# Altium project MB1168.PrjPCB (part 2 of 2)

## Sheet Power.SchDoc: Power
size A3; Project: STM32L073Z-EVAL; Date: Not used; ApprovedBy: Not used; CheckedBy: Not used; Author: Not used; CompanyName: STMicroelectronics; DrawnBy: Not used; Engineer: Not used; Organization: Not used; Address1: Not used; Address2: Not used; Address3: Not used; Address4: Not used; DocumentNumber: 4; Revision: Not used; SheetNumber: 5; SheetTotal: 13; CurrentTime: Not used; CurrentDate: Not used; Time: Not used; DocumentFullPathAndName: Not used; DocumentName: Not used; ModifiedDate: Not used; ImagePath: Not used; ProjectName: Not used; Application_BuildNumber: Not used
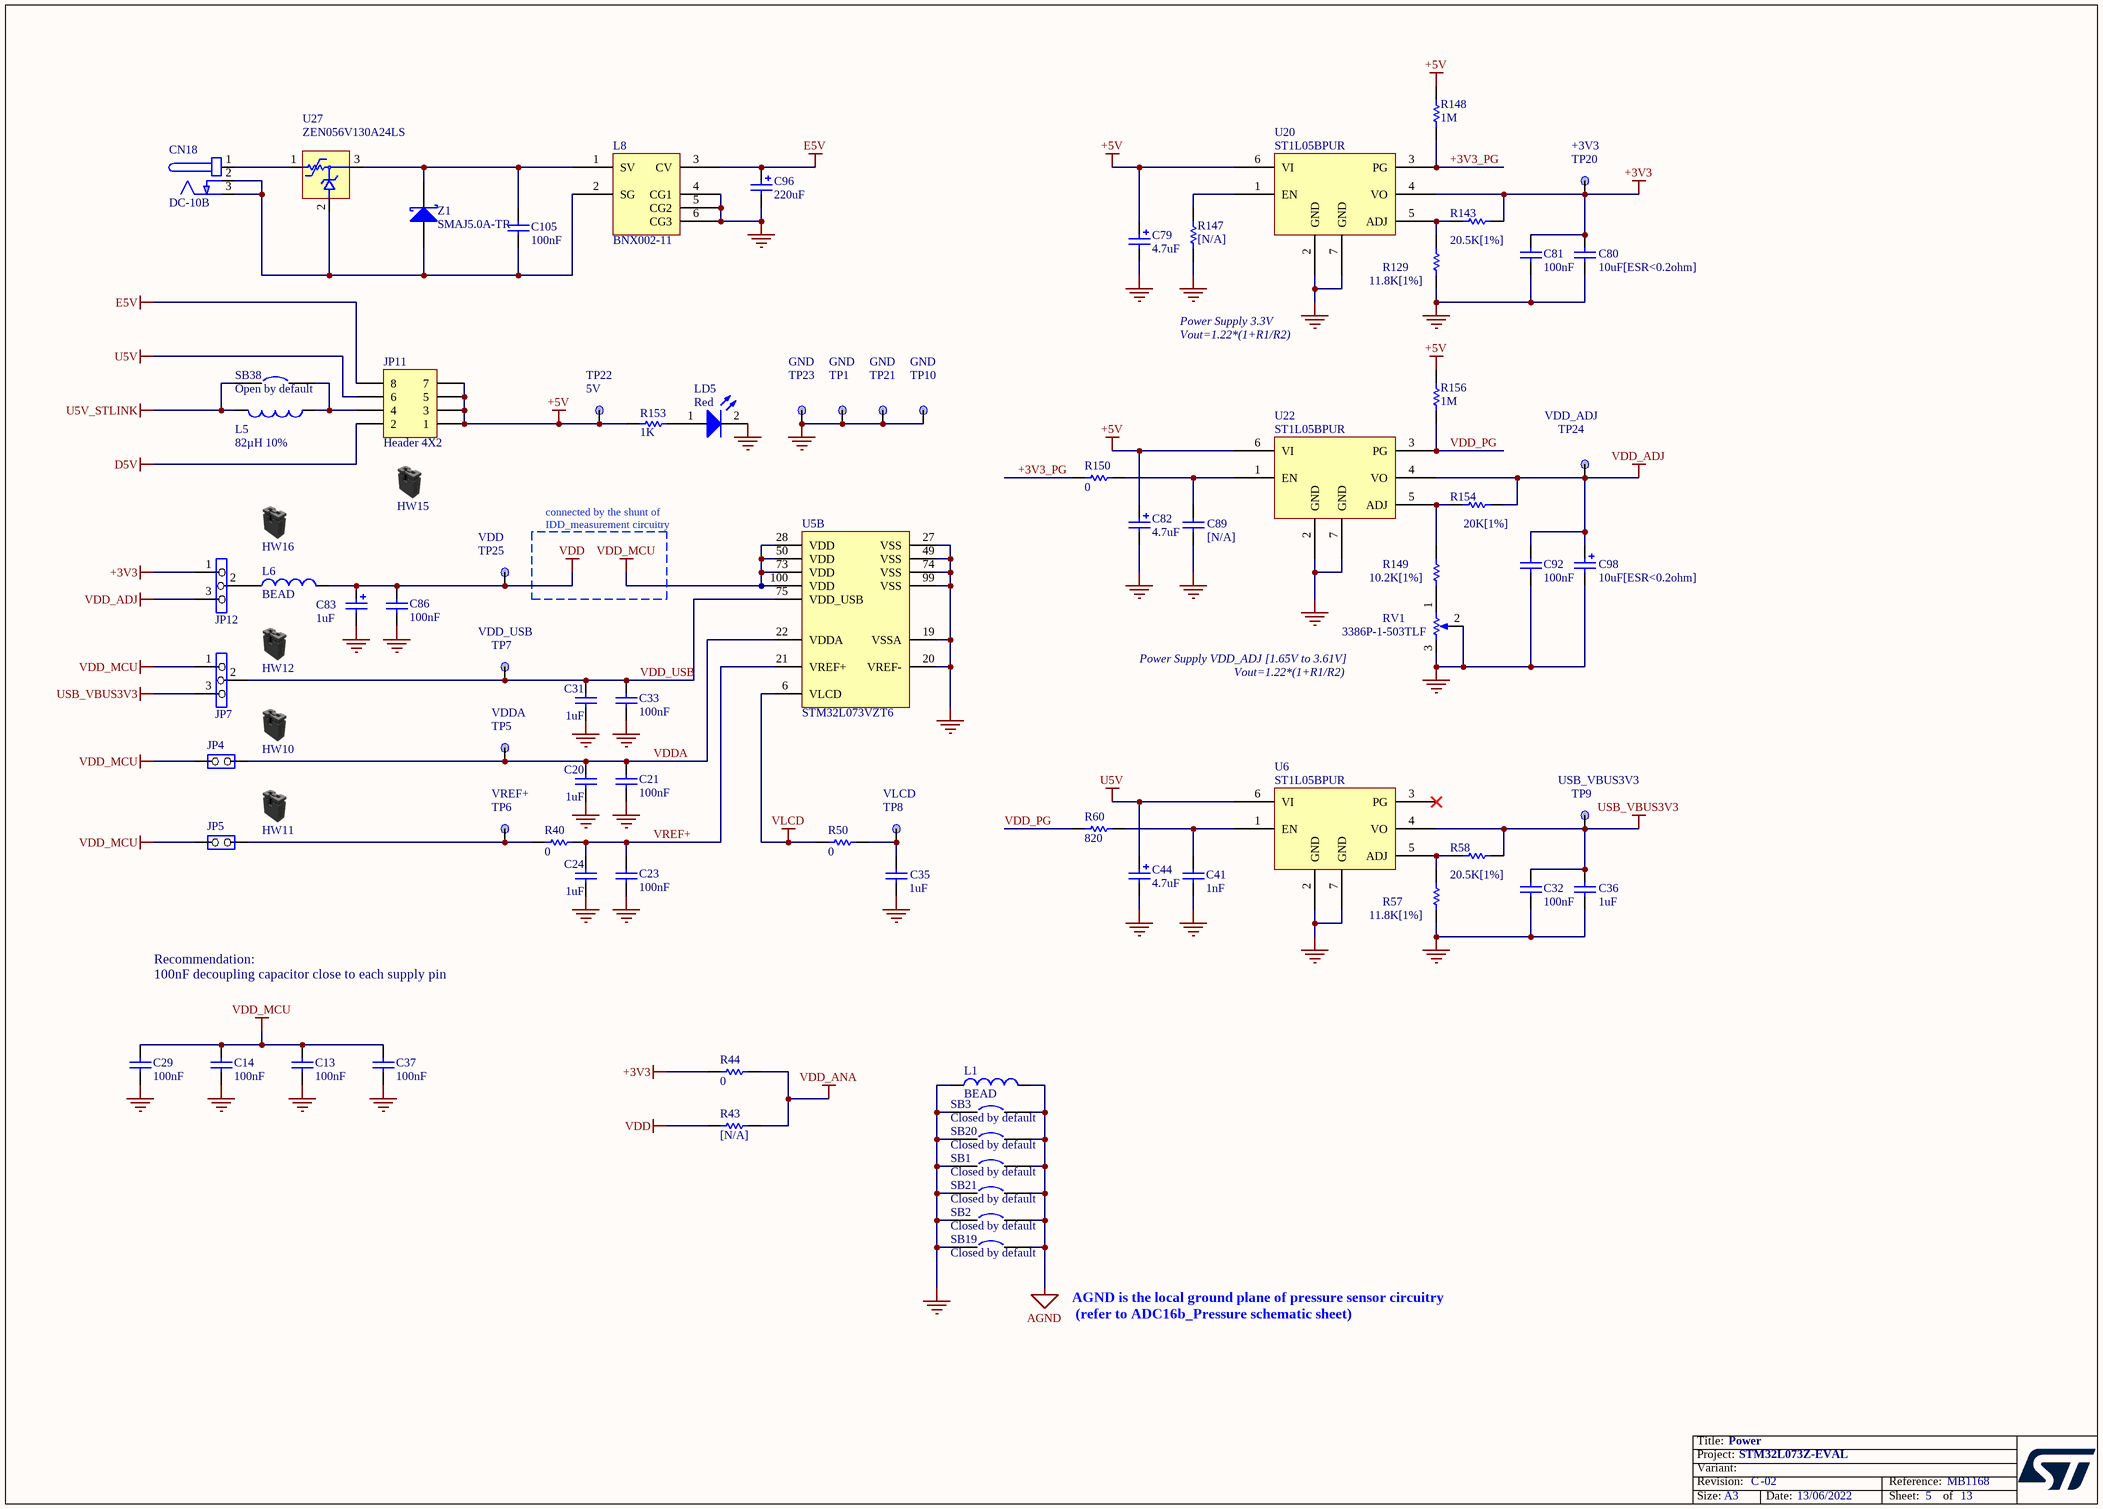
[diagram p4: Power.SchDoc]

### Parts
C13  100nF  [0402C]
C14  100nF  [0402C]
C20  1uF  [0603C]
C21  100nF  [0402C]
C23  100nF  [0402C]
C24  1uF  [0603C]
C29  100nF  [0402C]
C31  1uF  [0603C]
C32  100nF  [0402C]
C33  100nF  [0402C]
C35  1uF  [0603C]
C36  1uF  [0603C]
C37  100nF  [0402C]
C41  1nF  [0603C]
C44  4.7uF  [TAN-A]
C79  4.7uF  [TAN-A]
C80  10uF[ESR<0.2ohm]  [0805C]
C81  100nF  [0402C]
C82  4.7uF  [TAN-A]
C83  1uF  [TAN-A]
C86  100nF  [0402C]
C89  [N/A]  [0603C]
C92  100nF  [0402C]
C96  220uF  [c310m-6]
C98  10uF[ESR<0.2ohm]  [0805C]
C105  100nF  [0402C]
CN18  DC-10B  [PWR_JACK_DC10]
HW10  Shunt Black 2.54mm  (value not drawn)  (mechanical)
HW11  Shunt Black 2.54mm  (value not drawn)  (mechanical)
HW12  Shunt Black 2.54mm  (value not drawn)  (mechanical)
HW15  Shunt Black 2.54mm  (value not drawn)  (mechanical)
HW16  Shunt Black 2.54mm  (value not drawn)  (mechanical)
JP4  (no value)  [SIP2]
JP5  (no value)  [SIP2]
JP7  (no value)  [SIP3]
JP11  Header 4X2  [HDR_2X4_2R54]
JP12  (no value)  [SIP3]
L1  BEAD  [0603L]
L5  82µH 10%  [LSM2_4R9X4R9_H4R1]
L6  BEAD  [0603L]
L8  BNX002-11  [BNX001]
LD5  Red  [0603D]
R40  0  [0603R]
R43  [N/A]  [0603R]
R44  0  [0603R]
R50  0  [0603R]
R57  11.8K[1%]  [0603R]
R58  20.5K[1%]  [0603R]
R60  820  [0603R]
R129  11.8K[1%]  [0603R]
R143  20.5K[1%]  [0603R]
R147  [N/A]  [0603R]
R148  1M  [0603R]
R149  10.2K[1%]  [0603R]
R150  0  [0603R]
R153  1K  [0402R]
R154  20K[1%]  [0603R]
R156  1M  [0603R]
RV1  3386P-1-503TLF  [3386P]
SB1  Closed by default  [SB_0603]
SB2  Closed by default  [SB_0603]
SB3  Closed by default  [SB_0603]
SB19  Closed by default  [SB_0603]
SB20  Closed by default  [SB_0603]
SB21  Closed by default  [SB_0603]
SB38  Open by default  [SB_0603]
TP1  Silkscreen: GND  [TP]  (hidden comment: TP)
TP5  Silkscreen: VDDA  [TP]  (hidden comment: TP)
TP6  Silkscreen: VREF+  [TP]  (hidden comment: TP)
TP7  Silkscreen: VDD_USB  [TP]  (hidden comment: TP)
TP8  Silkscreen: VLCD  [TP]  (hidden comment: TP)
TP9  Silkscreen: USB_VBUS3V3  [TP]  (hidden comment: TP)
TP10  Silkscreen: GND  [TP]  (hidden comment: TP)
TP20  Silkscreen: +3V3  [TP]  (hidden comment: TP)
TP21  Silkscreen: GND  [TP]  (hidden comment: TP)
TP22  Silkscreen: 5V  [TP]  (hidden comment: TP)
TP23  Silkscreen: GND  [TP]  (hidden comment: TP)
TP24  Silkscreen: VDD_ADJ  [TP]  (hidden comment: TP)
TP25  Silkscreen: VDD  [TP]  (hidden comment: TP)
U5  STM32L073VZT6  [IC149_100_025_B5]  (part B of 2)
U6  ST1L05BPUR  [DFN6_0R95_3X3]
U20  ST1L05BPUR  [DFN6_0R95_3X3]
U22  ST1L05BPUR  [DFN6_0R95_3X3]
U27  ZEN056V130A24LS  [TYCO_ZEN056V130A24LS]
Z1  SMAJ5.0A-TR  [sma]

### Nets
+3V3: C80.1 C81.1 JP12.1 R44.1 R143.1 TP20.1 U20.4(VO)
+5V: C79.1 C82.1 JP11.1 JP11.3 JP11.5 JP11.7 R148.1 R153.2 R156.1 TP22.1 U20.6(VI) U22.6(VI)
AGND: L1.2 SB1.2 SB2.2 SB3.2 SB19.2 SB20.2 SB21.2
D5V: JP11.2
E5V: C96.1 JP11.8 L8.3(CV)
GND: C13.1 C14.1 C20.2 C21.1 C23.1 C24.2 C29.1 C31.2 C32.2 C33.1 C35.1 C36.2 C37.1 C41.2 C44.2 C79.2 C80.2 C81.2 C82.2 C83.2 C86.1 C89.1 C92.2 C96.2 C98.2 L1.1 L8.4(CG1) L8.5(CG2) L8.6(CG3) LD5.2(K) R57.2 R129.2 R147.2 RV1.2(TAP) RV1.3(TOP) SB1.1 SB2.1 SB3.1 SB19.1 SB20.1 SB21.1 TP1.1 TP10.1 TP21.1 TP23.1 U5.19(VSSA) U5.20(VREF-) U5.27(VSS) U5.49(VSS) U5.74(VSS) U5.99(VSS) U6.2(GND) U6.7(GND) U20.2(GND) U20.7(GND) U22.2(GND) U22.7(GND)
U5V: C44.1 JP11.6 U6.6(VI)
U5V_STLINK: L5.2 SB38.1
USB_VBUS3V3: C32.1 C36.1 JP7.3 R58.1 TP9.1 U6.4(VO)
VDD: C83.1 C86.2 L6.2 R43.1 TP25.1
VDD_ADJ: C92.1 C98.1 JP12.3 R154.1 TP24.1 U22.4(VO)
VDD_ANA: R43.2 R44.2
VDD_MCU: C13.2 C14.2 C29.2 C37.2 JP4.1(COMMON) JP5.1(COMMON) JP7.1 U5.28(VDD) U5.50(VDD) U5.73(VDD) U5.100(VDD)
VLCD: R50.1 U5.6(VLCD)
+3V3_PG: R148.2 R150.1 U20.3(PG)
VDD_PG: R60.1 R156.2 U22.3(PG)
VDD_USB: C31.1 C33.2 JP7.2 TP7.1 U5.75(VDD_USB)
VDDA: C20.1 C21.2 JP4.2(NO) TP5.1 U5.22(VDDA)
VREF+: C23.2 C24.1 R40.2 U5.21(VREF+)
NetC35_2: C35.2 R50.2 TP8.1
NetC41_1: C41.1 R60.2 U6.1(EN)
NetC89_2: C89.2 R150.2 U22.1(EN)
NetC105_1: C105.1 L8.1(SV) U27.3 Z1.2(K)
NetC105_2: C105.2 CN18.2(GND) CN18.3(GND) L8.2(SG) U27.2 Z1.1(A)
NetCN18_1: CN18.1(+) U27.1
NetJP5_2: JP5.2(NO) R40.1 TP6.1
NetJP11_4: JP11.4 L5.1 SB38.2
NetJP12_2: JP12.2 L6.1
NetLD5_1: LD5.1(A) R153.1
NetR57_1: R57.1 R58.2 U6.5(ADJ)
NetR129_1: R129.1 R143.2 U20.5(ADJ)
NetR147_1: R147.1 U20.1(EN)
NetR149_1: R149.1 R154.2 U22.5(ADJ)
NetR149_2: R149.2 RV1.1(BOT)

Not connected (* = marked no-connect by the designer): U6 3(PG)*

### Notes on the sheet
- Power Supply 3.3V
- Vout=1.22*(1+R1/R2)
- (near TP25) connected by the shunt of
  IDD_measurement circuitry
- Power Supply VDD_ADJ [1.65V to 3.61V]
- Recommendation:
  100nF decoupling capacitor close to each supply pin
- AGND is the local ground plane of pressure sensor circuitry
  (refer to ADC16b_Pressure schematic sheet)
- Title:
- Project:
- Size:
- Revision:
- Variant:
- A3
- -
- Date:
- Reference:
- Sheet:
- of

### Library data of the parts
C13 C14 C29 C37 = CAP: Capacitor; Ordered by: Subcon; Published: 8-Jun-2000; Revision: July-2002: Re-released for DXP Platform.; Publisher: Altium Limited; Value: 100nF; ECCN_US/EU: n/a
C20 C24 C31 C35 = CAP: Capacitor; Value: 100nF; Ordered by: Subcon; Published: 8-Jun-2000; Revision: July-2002: Re-released for DXP Platform.; Publisher: Altium Limited; ECCN_US/EU: n/a
C21 C23 C32 C33 C36 C41 C81 C86 C92 = Cap: Capacitor; Value: 10nF; Ordered by: Subcon; Published: 8-Jun-2000; Revision: July-2002: Re-released for DXP Platform.; Publisher: Altium Limited; ECCN_US/EU: n/a
C44 = Cap Pol1: Polarized Capacitor (Radial); Value: 100pF; Ordered by: Subcon; Published: 8-Jun-2000; Revision: July-2002: Re-released for DXP Platform.; Publisher: Altium Limited; ECCN_US/EU: n/a
C79 C82 C96 = Cap Pol1: Polarized Capacitor (Radial); Ordered by: Subcon; Published: 8-Jun-2000; Revision: July-2002: Re-released for DXP Platform.; Publisher: Altium Limited; ECCN_US/EU: n/a
  C79 C82: Value: 4.7uF
  C96: Value: 220uF
C80 = Cap: Capacitor; Value: 10uF; Ordered by: Subcon; Published: 8-Jun-2000; Revision: July-2002: Re-released for DXP Platform.; Publisher: Altium Limited; ECCN_US/EU: n/a
C83 = Cap Pol1: Polarized Capacitor; Ordered by: Subcon; Published: 8-Jun-2000; Revision: July-2002: Re-released for DXP Platform.; Publisher: Altium Limited; Value: 1uF; ECCN_US/EU: n/a
C89 = cap: Capacitor; Value: 100pF; Ordered by: Subcon; Fitted: NO; Published: 8-Jun-2000; Revision: July-2002: Re-released for DXP Platform.; Publisher: Altium Limited; ECCN_US/EU: n/a
C98 = Cap Pol1: Polarized Capacitor (Radial); Value: 10uF; Ordered by: Subcon; Published: 8-Jun-2000; Revision: July-2002: Re-released for DXP Platform.; Publisher: Altium Limited; ECCN_US/EU: n/a
C105 = CAP: Capacitor; Value: 100pF; Ordered by: Subcon; Published: 8-Jun-2000; Revision: July-2002: Re-released for DXP Platform.; Publisher: Altium Limited; ECCN_US/EU: n/a
CN18 = PJ202A: Manuf_1: wealthmetal; Manuf_Part_1: DC-005-2.5; Ordered by: Subcon; Comments: power jack; Silkscreen: PSU_E5V; ECCN_US/EU: n/a
JP4 = JP2: Ordered by: Subcon; Silkscreen: VDDA; Assembly: closed; ECCN_US/EU: n/a
JP5 = JP2: Ordered by: Subcon; Silkscreen: VREF+; Assembly: closed; ECCN_US/EU: n/a
JP7 = Jumper3: Ordered by: Subcon; Silkscreen: 1,2: VDD_MCU / 2,3: VBUS; Assembly: 1-2 closed (MCU); ECCN_US/EU: n/a
JP11 = Header 4X2: Header, 4-Pin, Dual row; Ordered by: Subcon; Silkscreen: 7,8: E5V /5,6: U5V / 3,4: STlk / 1,2: D5V; Assembly: 7-8 (E5V); Revision: 17-Jul-2002: Re-released for DXP Platform.; Publisher: Altium Limited; ECCN_US/EU: n/a
JP12 = Jumper3: Ordered by: Subcon; Silkscreen: 1,2: +3V3 / 2,3: VDD_ADJ; Assembly: 1-2 (+3V3); ECCN_US/EU: n/a
L1 L6 = Inductor: Bead,600R,350mA,0603; Manuf_1: Tai-tech; Manuf_Part_1: FCM1608KF-601T05; Manuf_2: Wurth Elektronik; Manuf_Part_2: 742863160; Value: 100uH; Ordered by: Subcon; Published: 8-Jun-2000; Revision: July-2002: Re-released for DXP Platform.; Publisher: Altium Limited; ECCN_US/EU: n/a
L5 = Ind_82µH_0.65A_10%: Power Inductor 82µH 0,65A; Manuf_Part_1: PSI054T-820MS-11; Manuf_1: CYNTEC; Manuf_Part_2: A916CY-820M; Manuf_2: TOKO; Order_2: 752-1406; Ordered by: Subcon; Distrib: Jiubaba; Distrib_2: FARNELL; ECCN_US/EU: n/a
L8 = BNX002: Manuf_1: MURATA; Ordered by: Subcon; ECCN_US/EU: n/a; Manuf_Part_1: BNX002-11
LD5 = LED2: Typical RED, GREEN, YELLOW, AMBER GaAs LED; Ordered by: Subcon; Silkscreen: +5V; Published: 8-Jun-2000; Revision: July-2002: Re-released for DXP Platform.; Publisher: Altium Limited; ECCN_US/EU: n/a
R40 R44 R50 R57 R58 R129 R143 R149 R154 = Res1: Resistor; Value: 1K; Ordered by: Subcon; Published: 8-Jun-2000; Revision: July-2002: Re-released for DXP Platform.; Publisher: Altium Limited; ECCN_US/EU: n/a
R43 R147 = res1: Resistor; Value: 1K; Ordered by: Subcon; Fitted: NO; Published: 8-Jun-2000; Revision: July-2002: Re-released for DXP Platform.; Publisher: Altium Limited; ECCN_US/EU: n/a
R60 R148 R150 R156 = res1: Resistor; Value: 1K; Ordered by: Subcon; Published: 8-Jun-2000; Revision: July-2002: Re-released for DXP Platform.; Publisher: Altium Limited; ECCN_US/EU: n/a
R153 = res1: Resistor; Ordered by: Subcon; Published: 8-Jun-2000; Revision: July-2002: Re-released for DXP Platform.; Publisher: Altium Limited; Value: 1K; ECCN_US/EU: n/a
RV1 = RV: Potentiometer 50K; Ordered by: Subcon; Comments: 50K potentiometer; Silkscreen: VDD_ADJ; ECCN_US/EU: n/a
SB1-SB3 SB19-SB21 = Circuit Breaker: Ordered by: Subcon; Comments: Solder bridge; Published: 24-Mar-1999; Revision: July-2002: Re-released for DXP Platform.; Publisher: Altium Limited; ECCN_US/EU: n/a
SB38 = Circuit Breaker: Ordered by: Subcon; Comments: Solder bridge; Fitted: NO; Published: 24-Mar-1999; Revision: July-2002: Re-released for DXP Platform.; Publisher: Altium Limited; ECCN_US/EU: n/a
TP1 TP5-TP10 TP20-TP25 = TP: Ordered by: Subcon; Fitted: NO; ECCN_US/EU: n/a
U5 = BigNemo: Manuf_Part_1: FG=32L073VZT6$x3 cut 2.0 marking "B"; Ordered by: ST; ECCN_US/EU: 3A991A2/NEC; Ref St: 9175165; Manuf_1: ST
U6 U20 U22 = ST1L05: Ordered by: ST; ECCN_US/EU: EAR99/NEC; Ref St: 9176239; Manuf_1: ST; Manuf_Part_1: ST1L05BPUR
U27 = ZEN056V130A24LS: Ordered by: Subcon; ECCN_US/EU: EAR99/NEC
Z1 = D Schottky: Schottky Diode; Code - JEDEC: DO-214-AA; Ordered by: Subcon; ECCN_US/EU: EAR99/NEC; Published: 8-Jun-2000; Revision: July-2002: Re-released for DXP Platform.; Publisher: Altium Limited

## Sheet USART_LPUART.SchDoc: USART_LPUART
size A3; Project: STM32L073Z-EVAL; Date: Not used; ApprovedBy: Not used; CheckedBy: Not used; Author: Not used; CompanyName: STMicroelectronics; DrawnBy: Not used; Engineer: Not used; Organization: Not used; Address1: Not used; Address2: Not used; Address3: Not used; Address4: Not used; DocumentNumber: 7; Revision: Not used; SheetNumber: 8; SheetTotal: 13; CurrentTime: Not used; CurrentDate: Not used; Time: Not used; DocumentFullPathAndName: Not used; DocumentName: Not used; ModifiedDate: Not used; ImagePath: Not used; ProjectName: Not used; Application_BuildNumber: Not used
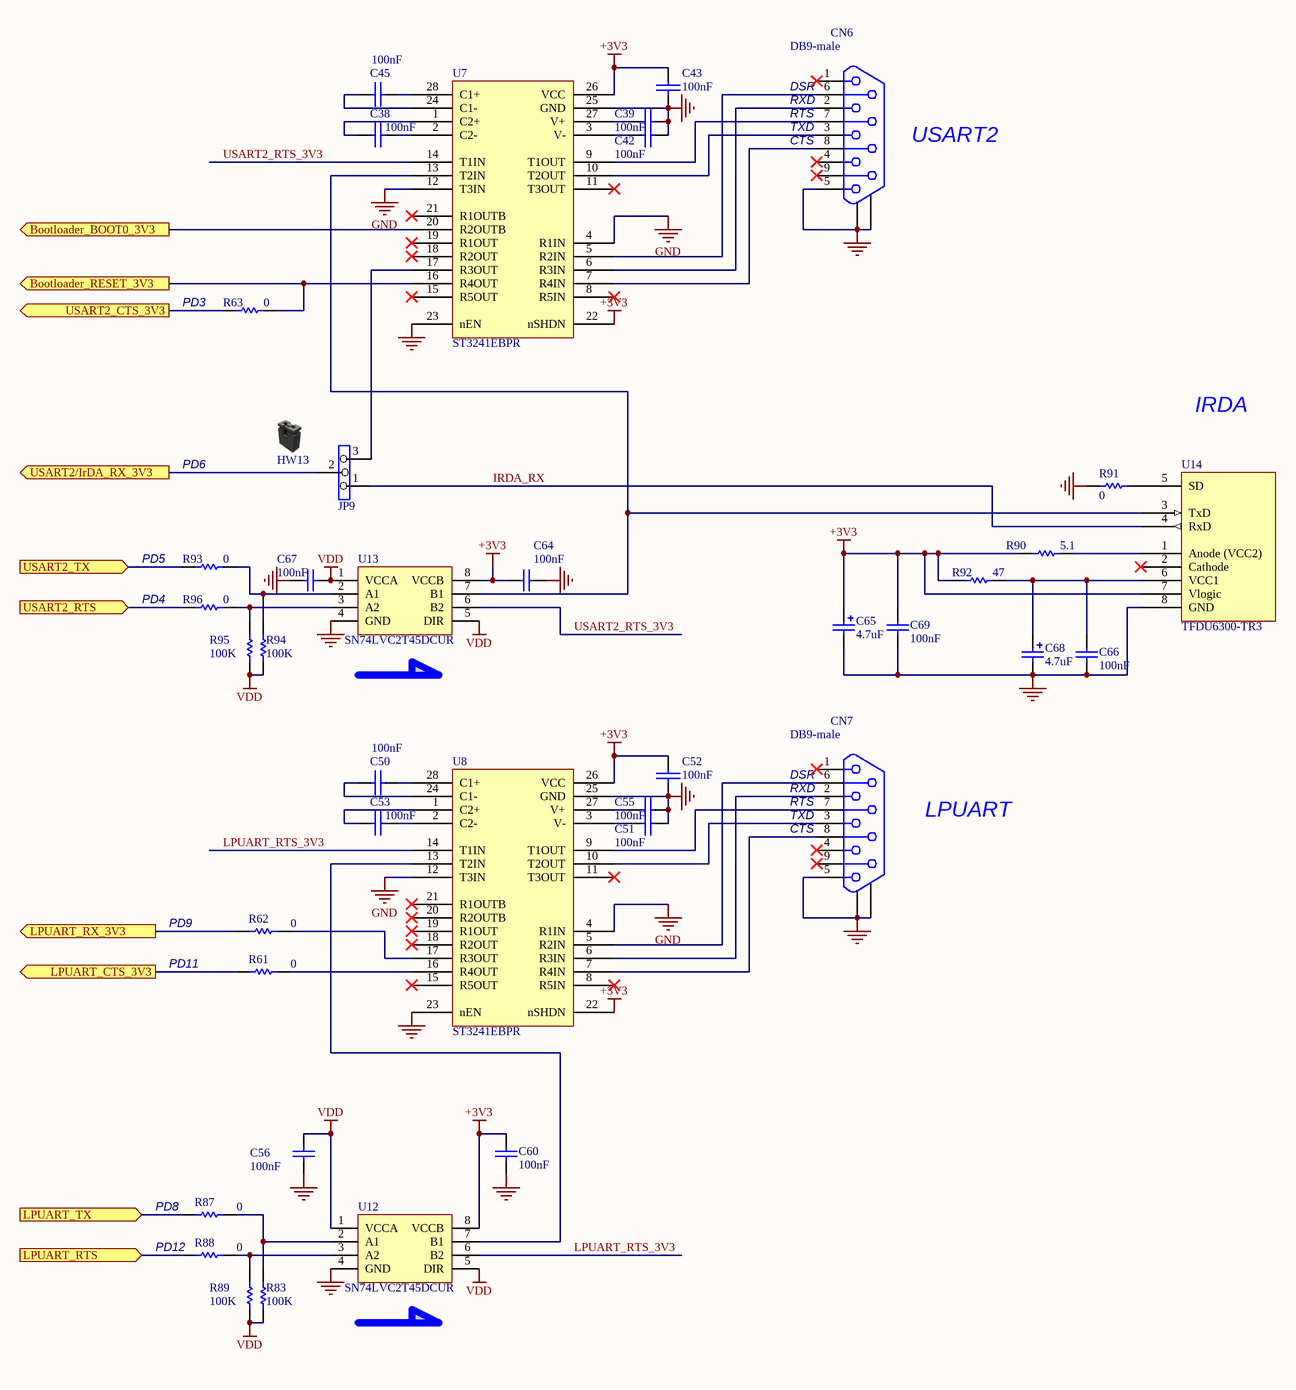
[diagram p5: USART_LPUART.SchDoc]

### Parts
C38  100nF  [0402C]
C39  100nF  [0402C]
C42  100nF  [0402C]
C43  100nF  [0402C]
C45  100nF  [0402C]
C50  100nF  [0402C]
C51  100nF  [0402C]
C52  100nF  [0402C]
C53  100nF  [0402C]
C55  100nF  [0402C]
C56  100nF  [0402C]
C60  100nF  [0402C]
C64  100nF  [0402C]
C65  4.7uF  [TAN-A]
C66  100nF  [0402C]
C67  100nF  [0402C]
C68  4.7uF  [TAN-A]
C69  100nF  [0402C]
CN6  DB9-male  [DB9/M]
CN7  DB9-male  [DB9/M]
HW13  Shunt Black 2.54mm  (value not drawn)  (mechanical)
JP9  (no value)  [SIP3]
R61  0  [0603R]
R62  0  [0603R]
R63  0  [0603R]
R83  100K  [0402R]
R87  0  [0603R]
R88  0  [0603R]
R89  100K  [0402R]
R90  5.1  [0402R]
R91  0  [0603R]
R92  47  [0402R]
R93  0  [0603R]
R94  100K  [0402R]
R95  100K  [0402R]
R96  0  [0603R]
U7  ST3241EBPR  [SSOP28_0R65_10R2X7R8]
U8  ST3241EBPR  [SSOP28_0R65_10R2X7R8]
U12  SN74LVC2T45DCUR  [USOP8_0R5_2X3R1]
U13  SN74LVC2T45DCUR  [USOP8_0R5_2X3R1]
U14  TFDU6300-TR3  [IR_VISHAY3]

### Ports
Bootloader_BOOT0_3V3 (out), Bootloader_RESET_3V3 (out), LPUART_CTS_3V3 (out), LPUART_RTS (in), LPUART_RX_3V3 (out), LPUART_TX (in), USART2/IrDA_RX_3V3 (out), USART2_CTS_3V3 (out), USART2_RTS (in), USART2_TX (in)

### Nets
+3V3: C43.2 C52.2 C60.2 C64.2 C65.1 C69.2 R90.1 R92.1 U7.22(nSHDN) U7.26(VCC) U8.22(nSHDN) U8.26(VCC) U12.8(VCCB) U13.8(VCCB) U14.7(Vlogic)
GND: C39.2 C42.2 C43.1 C51.2 C52.1 C55.2 C56.1 C60.1 C64.1 C65.2 C66.1 C67.1 C68.2 C69.1 CN6.5 CN6.10 CN6.11 CN7.5 CN7.10 CN7.11 R91.2 U7.4(R1IN) U7.12(T3IN) U7.23(nEN) U7.25(GND) U8.4(R1IN) U8.12(T3IN) U8.23(nEN) U8.25(GND) U12.4(GND) U13.4(GND) U14.8(GND)
VDD: C56.2 C67.2 R83.2 R89.2 R94.2 R95.2 U12.1(VCCA) U12.5(DIR) U13.1(VCCA) U13.5(DIR)
IRDA_RX: JP9.1 U14.4(RxD)
LPUART_RTS_3V3: U8.14(T1IN) U12.6(B2)
PD3: R63.2 ; port USART2_CTS_3V3
PD4: R96.2 ; port USART2_RTS
PD5: R93.2 ; port USART2_TX
USART2_RTS_3V3: U7.14(T1IN) U13.6(B2)
NetC38_1: C38.1 U7.1(C2+)
NetC38_2: C38.2 U7.2(C2-)
NetC39_1: C39.1 U7.27(V+)
NetC42_1: C42.1 U7.3(V-)
NetC45_1: C45.1 U7.24(C1-)
NetC45_2: C45.2 U7.28(C1+)
NetC50_1: C50.1 U8.24(C1-)
NetC50_2: C50.2 U8.28(C1+)
NetC51_1: C51.1 U8.3(V-)
NetC53_1: C53.1 U8.1(C2+)
NetC53_2: C53.2 U8.2(C2-)
NetC55_1: C55.1 U8.27(V+)
NetC66_2: C66.2 C68.1 R92.2 U14.6(VCC1)
NetCN6_2: CN6.2 U7.6(R3IN)
NetCN6_3: CN6.3 U7.10(T2OUT)
NetCN6_6: CN6.6 U7.5(R2IN)
NetCN6_7: CN6.7 U7.9(T1OUT)
NetCN6_8: CN6.8 U7.7(R4IN)
NetCN7_2: CN7.2 U8.6(R3IN)
NetCN7_3: CN7.3 U8.10(T2OUT)
NetCN7_6: CN7.6 U8.5(R2IN)
NetCN7_7: CN7.7 U8.9(T1OUT)
NetCN7_8: CN7.8 U8.7(R4IN)
NetD2_2: R63.1 U7.16(R4OUT) ; port Bootloader_RESET_3V3
NetJP9_2: JP9.2 ; port USART2/IrDA_RX_3V3
NetJP9_3: JP9.3 U7.17(R3OUT)
NetR35_2: U7.20(R2OUTB) ; port Bootloader_BOOT0_3V3
NetR61_1: R61.1 ; port LPUART_CTS_3V3
NetR61_2: R61.2 U8.16(R4OUT)
NetR62_1: R62.1 ; port LPUART_RX_3V3
NetR62_2: R62.2 U8.17(R3OUT)
NetR83_1: R83.1 R87.2 U12.2(A1)
NetR87_1: R87.1 ; port LPUART_TX
NetR88_1: R88.1 ; port LPUART_RTS
NetR88_2: R88.2 R89.1 U12.3(A2)
NetR90_2: R90.2 U14.1(Anode_(VCC2))
NetR91_1: R91.1 U14.5(SD)
NetR93_1: R93.1 R94.1 U13.2(A1)
NetR95_1: R95.1 R96.1 U13.3(A2)
NetU7_13: U7.13(T2IN) U13.7(B1) U14.3(TxD)
NetU8_13: U8.13(T2IN) U12.7(B1)

Not connected (* = marked no-connect by the designer): CN6 1* 4* 9*; CN7 1* 4* 9*; U7 8(R5IN)* 11(T3OUT)* 15(R5OUT)* 18(R2OUT)* 19(R1OUT)* 21(R1OUTB)*; U8 8(R5IN)* 11(T3OUT)* 15(R5OUT)* 18(R2OUT)* 19(R1OUT)* 20(R2OUTB)* 21(R1OUTB)*; U14 2(Cathode)*

### Notes on the sheet
- (near CN6) RXD
- (near CN6) DSR
- (near CN6) RTS
- (near CN6) TXD
- (near CN6) CTS
- (near CN6) USART2
- (near R63) PD3
- IRDA
- PD6
- PD5
- PD4
- (near CN7) DSR
- (near CN7) RXD
- (near CN7) RTS
- (near CN7) TXD
- (near CN7) CTS
- LPUART
- PD11
- PD9
- (near R88) PD12
- (near R87) PD8
- Title:
- Project:
- Size:
- Revision:
- Variant:
- A3
- -
- Date:
- Reference:
- Sheet:
- of

### Library data of the parts
C38 C39 C42 C43 C45 C50-C53 C55 = CAP: Capacitor; Ordered by: Subcon; ECCN_US/EU: n/a
C56 C60 C64 C66 C67 C69 = CAP: as C105 on sheet Power; Published: 8-Jun-2000; Revision: July-2002: Re-released for DXP Platform.; Publisher: Altium Limited; ECCN_US/EU: n/a
C65 C68 = Cap Pol1: as C79 on sheet Power; Published: 8-Jun-2000; Revision: July-2002: Re-released for DXP Platform.; Publisher: Altium Limited; ECCN_US/EU: n/a
  C65: Value: 4.7 uF
  C68: Value: 4.7uF
CN6 = DB9: Manuf_1: lwconn; Manuf_Part_1: 50209M30111; Ordered by: Subcon; Comments: DB9 USART; Silkscreen: USART2; ECCN_US/EU: n/a
CN7 = DB9: Manuf_1: lwconn; Manuf_Part_1: 50209M30111; Ordered by: Subcon; Comments: DB9 USART; Silkscreen: LPUART; ECCN_US/EU: n/a
JP9 = Jumper3: Ordered by: Subcon; Silkscreen: 1,2: IRDA / 2,3: USART; Assembly: 2-3 (USART); ECCN_US/EU: n/a
R61-R63 R83 R87-R96 = Res1: Resistor; Value: 1K; Ordered by: Subcon; Published: 8-Jun-2000; Revision: July-2002: Re-released for DXP Platform.; Publisher: Altium Limited; ECCN_US/EU: n/a
U7 U8 = ST3241: Ordered by: ST; ECCN_US/EU: EAR99/NEC; Ref St: 9176312; Manuf_1: ST; Manuf_Part_1: ST3241EBPR
U12 U13 = SN74LVC2T45DCUT: Ordered by: Subcon; ECCN_US/EU: EAR99/NEC
U14 = TFDU4300: Ordered by: Subcon; ECCN_US/EU: EAR99/NEC

## Nets that join several sheets
+3V3: IDD_measurement (R170.1), Power (7 pins), USART_LPUART (15 pins)
+5V: IDD_measurement (R151.1), Power (12 pins)
GND: MCU (13 pins), IDD_measurement (29 pins), Power (57 pins), USART_LPUART (32 pins)
VDD: MCU (R53.2 R56.2 R213.2 SW1.1), IDD_measurement (23 pins), Power (5 pins), USART_LPUART (10 pins)
VDD_MCU: MCU (C28.2 R47.1), IDD_measurement (JP10.2 R180.2), Power (11 pins)
NetD2_2: MCU (D2.2), USART_LPUART (R63.1 U7.16)
NetR35_2: MCU (R35.2), USART_LPUART (U7.20)
PD3: MCU (U5.84), USART_LPUART (R63.2)
PD4: MCU (U5.85), USART_LPUART (R96.2)
PD5: MCU (U5.86), USART_LPUART (R93.2)
PE6: MCU (U5.5), IDD_measurement (R166.1)
PH10: MCU (R47.2 U5.11), IDD_measurement (R158.1)
RESET#: MCU (6 pins), IDD_measurement (D8.2)

## Assembly variants
L073VZT6: not fitted C2 C15 C16 C47 C57 C61 C62 C84 C89 C95 CN15 CN19 L3 R3 R30 R43 R46 R47 R99 R100 R101 R108 R110 R120 R128 R141 R147 R155 R176 R183 R213 SB6 SB7 SB8 SB10 SB11 SB15 SB17 SB23 SB24 SB25 SB26 SB27 SB28 SB32 SB33 SB34 SB36 SB38 SB41 T2 T4 T6 T8 T10 TP1 TP2 TP3 TP4 TP5 TP6 TP7 TP8 TP9 TP10 TP14 TP18 TP20 TP21 TP22 TP23 TP24 TP25 TP26 TP27 TP28 TP29 TP31